# EAGLE schematic stable_grid_optocoupler (EAGLE 7.3.0)
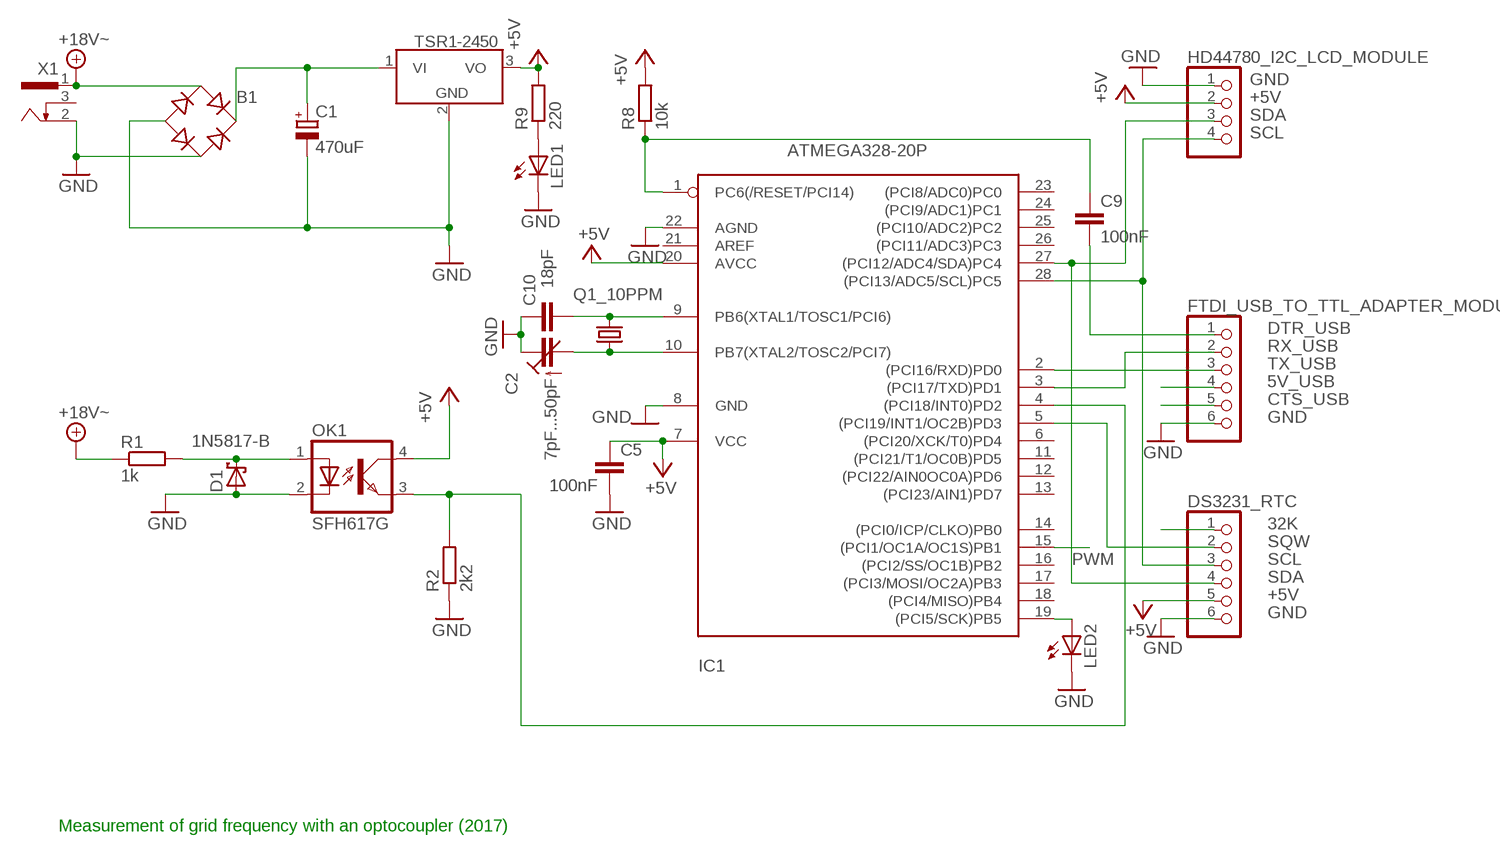
[diagram p0: schematic, sheet 1]

## Parts
B1  B-DIL  [B-DIL]
C1  470uF  CPOL-EU085CS-1AR  [085CS_1AR]
C2  7pF...50pF  C-TRIMM808  [CTRIM808-BC]
C5  100nF  C-EU025-024X044  [C025-024X044]
C9  100nF  C-EU025-024X044  [C025-024X044]
C10  18pF  C-EU025-024X044  [C025-024X044]
D1  1N5817-B  [DO41-7.6]
DS3231_RTC  PINHD-1X6  [1X06]
FTDI_USB_TO_TTL_ADAPTER_MODULE  PINHD-1X6  [1X06]
HD44780_I2C_LCD_MODULE  PINHD-1X4  [1X04]
IC1  ATMEGA328-20P  [DIL28-3]
LED1  LAP4-BOTTOM  [P47F-BOTTOM]
LED2  LYP4-BOTTOM  [P47F-BOTTOM]
OK1  SFH617G  [DIL04B]
Q1_10PPM  CRYSTALHC49S  [HC49/S]
R1  1k  R-EU_M0805  [M0805]
R2  2k2  R-EU_M0805  [M0805]
R8  10k  R-EU_M0805  [M0805]
R9  220  R-EU_M0805  [M0805]
TSR1-2450  TSR_1-24_  [TSR-1]
X1  9V  733980-62  [733980-62]

## Nets
5V_USB: FTDI_USB_TO_TTL_ADAPTER_MODULE.4
32K: DS3231_RTC.1
+: B1.+ C1.+ TSR1-2450.1(VI)
+5V: C5.1 DS3231_RTC.5 HD44780_I2C_LCD_MODULE.2 IC1.7(VCC) IC1.20(AVCC) OK1.4(COL) R8.2 R9.2 TSR1-2450.3(VO)
+18V: B1.AC1 R1.1 X1.1 ; supply symbol labelled +18V~
CTS_USB: FTDI_USB_TO_TTL_ADAPTER_MODULE.5
DTR_USB: C9.2 FTDI_USB_TO_TTL_ADAPTER_MODULE.1
GND: B1.- B1.AC2 C1.- C2.1(E) C5.2 C10.1 D1.A DS3231_RTC.6 FTDI_USB_TO_TTL_ADAPTER_MODULE.6 HD44780_I2C_LCD_MODULE.1 IC1.8(GND) IC1.22(AGND) LED1.C LED2.C OK1.2(C) R2.1 TSR1-2450.2(GND) X1.2
N$1: IC1.19((PCI5/SCK)PB5) LED2.A
N$3: D1.C OK1.1(A) R1.2
N$4: C10.2 IC1.9(PB6(XTAL1/TOSC1/PCI6)) Q1_10PPM.2
N$7: LED1.A R9.1
N$8: C2.2(A) IC1.10(PB7(XTAL2/TOSC2/PCI7)) Q1_10PPM.1
N$9: IC1.4((PCI18/INT0)PD2) OK1.3(EMIT) R2.2
N$10: C9.1 IC1.1(PC6(/RESET/PCI14)) R8.1
PWM: IC1.15((PCI1/OC1A/OC1S)PB1)
RX_USB: FTDI_USB_TO_TTL_ADAPTER_MODULE.2 IC1.3((PCI17/TXD)PD1)
SCL: DS3231_RTC.3 HD44780_I2C_LCD_MODULE.4 IC1.28((PCI13/ADC5/SCL)PC5)
SDA: DS3231_RTC.4 HD44780_I2C_LCD_MODULE.3 IC1.27((PCI12/ADC4/SDA)PC4)
SQW: DS3231_RTC.2 IC1.5((PCI19/INT1/OC2B)PD3)
TX_USB: FTDI_USB_TO_TTL_ADAPTER_MODULE.3 IC1.2((PCI16/RXD)PD0)
Unconnected: IC1.6((PCI20/XCK/T0)PD4) IC1.11((PCI21/T1/OC0B)PD5) IC1.12((PCI22/AIN0OC0A)PD6) IC1.13((PCI23/AIN1)PD7) IC1.14((PCI0/ICP/CLKO)PB0) IC1.16((PCI2/SS/OC1B)PB2) IC1.17((PCI3/MOSI/OC2A)PB3) IC1.18((PCI4/MISO)PB4) IC1.21(AREF) IC1.23((PCI8/ADC0)PC0) IC1.24((PCI9/ADC1)PC1) IC1.25((PCI10/ADC2)PC2) IC1.26((PCI11/ADC3)PC3) X1.3

## Notes on the sheet
- Measurement of grid frequency with an optocoupler (2017)

## Library data of the parts
B1 = rectifier:B-DIL: RECTIFIER
C1 = rcl:CPOL-EU: POLARIZED CAPACITOR, European symbol
C2 = rcl:C-TRIMM: Trimm capacitor
C5 C9 C10 = rcl:C-EU: CAPACITOR, European symbol
D1 = diode:1N581*: 1.0A SCHOTTKY BARRIER RECTIFIER Source: http://www.diodes.com/datasheets/ds23001.pdf
DS3231_RTC FTDI_USB_TO_TTL_ADAPTER_MODULE = pinhead:PINHD-1X6: PIN HEADER
HD44780_I2C_LCD_MODULE = pinhead:PINHD-1X4: PIN HEADER
IC1 = atmega328:ATMEGA328*P: MICROCONTROLLER 32 kBytes FLASH 2 kBytes SRAM 1 kBytes EEPROM USART 8-channel 10 bit ADC
LED1 LED2 = led:*P4: PointLED® Enhanced Thinfilm LED TOP & BOTTOM mount LS P47F, LR P47F, LA P47F, LY P47F, LT P4SG, LB P4SG, LW P4SG Source: http://catalog.osram-os.com .. LA_LR_LS_LY_P47F_Pb_free.pdf
OK1 = optocoupler:SFH617G: SIEMENS OPTO COUPLER; MF: VISHAY/TELEFUNKEN; MPN: SFH617A-3; OC_FARNELL: 1469581; OC_NEWARK: 58K2207
Q1_10PPM = crystal:CRYSTAL: CRYSTAL; OC_FARNELL: 1667008; OC_NEWARK: unknown
R1 R2 R8 R9 = rcl:R-EU_: RESISTOR, European symbol
TSR1-2450 = _traco_tsr-1:TSR_1-*: TRACO TSR-1 Series Point-of-Load DC/DC-Converters Vi max. 36 V; Vo = (1.2 .. 15)V ±2%; Io = 0 .. 1 A SIP-Package (drop-in replacement for 78xx linear voltage regulators in TO220-package, vertically assembled) Source: www.tracopower.com Technologies: TSR 1- Vi (V) Vo (V) ±2% Io = 0 .. 1 A 24_ ( generic ) 2412 4.6 .. 36 1.2 2415 4.6 .. 36 1.5 2418 4.6 .. 36 1.8 2425 4.6 .. 36 2.5 2433 4.75.. 36 3.3 2450 6.5 .. 36 5.0 2465 9.0 .. 36 6.5 2490 12 .. 36 9.0 24120 15 .. 36 12 24150 18 .. 36 15 Author: Dipl.-Ing. FH Rainer Bayer HHN Hochschule Heilbronn, rainer.bayer@hs-heilbronn.de Ingenieurbüro ing-rb, mail@ing-rb.de
X1 = con-conrad:73398?: FEMALE PRINT CONNECTOR Niedervolt-Steckverbinder Distributor Conrad